# Altium schematic sheet RS422_ADM3076.SchDoc
size A3
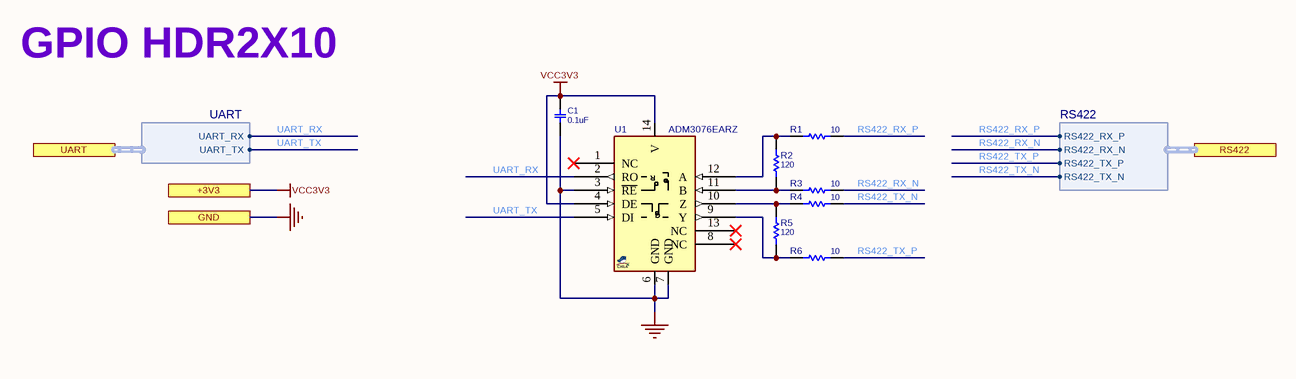
[diagram p0: RS422_ADM3076.SchDoc]

## Parts
C1  0.1uF  [C0402]
R1  10  [R0402]
R2  120  [R0603]
R3  10  [R0402]
R4  10  [R0402]
R5  120  [R0603]
R6  10  [R0402]
U1  ADM3076EARZ  [SO_14]

## Ports
+3V3, GND, RS422 (harness RS422), UART (harness UART)

## Harnesses
RS422: RS422_RX_P, RS422_RX_N, RS422_TX_P, RS422_TX_N
UART: UART_RX, UART_TX

## Nets
GND: C1.1 U1.3(~{RE}) U1.6(GND) U1.7(GND) ; port GND
VCC3V3: C1.2 U1.4(DE) U1.14(V) ; port +3V3
RS422_RX_N: R3.2 ; port RS422.RS422_RX_N
RS422_RX_P: R1.2 ; port RS422.RS422_RX_P
RS422_TX_N: R4.2 ; port RS422.RS422_TX_N
RS422_TX_P: R6.2 ; port RS422.RS422_TX_P
UART_RX: U1.2(RO) ; port UART.UART_RX
UART_TX: U1.5(DI) ; port UART.UART_TX
NetR1_1: R1.1 R2.2 U1.12(A)
NetR2_1: R2.1 R3.1 U1.11(B)
NetR4_1: R4.1 R5.2 U1.10(Z)
NetR5_1: R5.1 R6.1 U1.9(Y)

Not connected (* = marked no-connect by the designer): U1 1(NC)* 8(NC)* 13(NC)*

## Notes on the sheet
- GPIO HDR2X10
- Title
- Size:
- Date:
- A3
- Number:
- Time:
- Revision:
- Sheet
- of
- File:
- (in symbol MAX491_SOP14) R; D

## Library data of the parts
C1 = CAP_SMD_MLCC_100n50T: CAP, MLCC, 100nF, 50V, X7R, 10%, 0402C; MANF_P#: UMK105B7104KVHF; MANF: Taiyo Yuden; PARAM: 50V; DESC: CAP, MLCC, 100nF, 50V, X7R, 10%, 0402C; PARAM2: X7R, 10%; ASSEMBLY: ASSEMBLY; PRICE: 100= 5$; VALUE: 0.1uF
R1 R3 R4 R6 = RES_SMD_10K_0402: RESISTOR, SMD; MANF: Yageo; PARAM: 0.063W; DESC: DESCRIPTION; DIST#: MOUSER; PARAM2: 1%; MANF_P#: RC0402FR-0710RL; ASSEMBLY: ASSEMBLY; PRICE: 100= 0.8$; VALUE: 10
R2 R5 = RES_SMD_10K_0402: RESISTOR, SMD; PARAM: 0.063W; DESC: DESCRIPTION; DIST#: MOUSER; PARAM2: 1%; MANF: -; ASSEMBLY: ASSEMBLY; PRICE: 100= 0.8$; VALUE: 120; MANF_P#: -
U1 = MAX491_SOP14: RS-485/RS-422 Transceiver, FULL-DUPLEX; MANF: Maxim Integrated; MANF_P#: ADM3076EARZ; VALUE: ADM3076EARZ